# EasyEDA schematic 平衡车3.0.json

## Sheets
1 Sheet_1: TITLE: 平衡车; REV: 1.0; Date: 2022-01-08; Sheet: 1/4; Drawn By: Uchiha-Leslie; Company: 南京师范大学
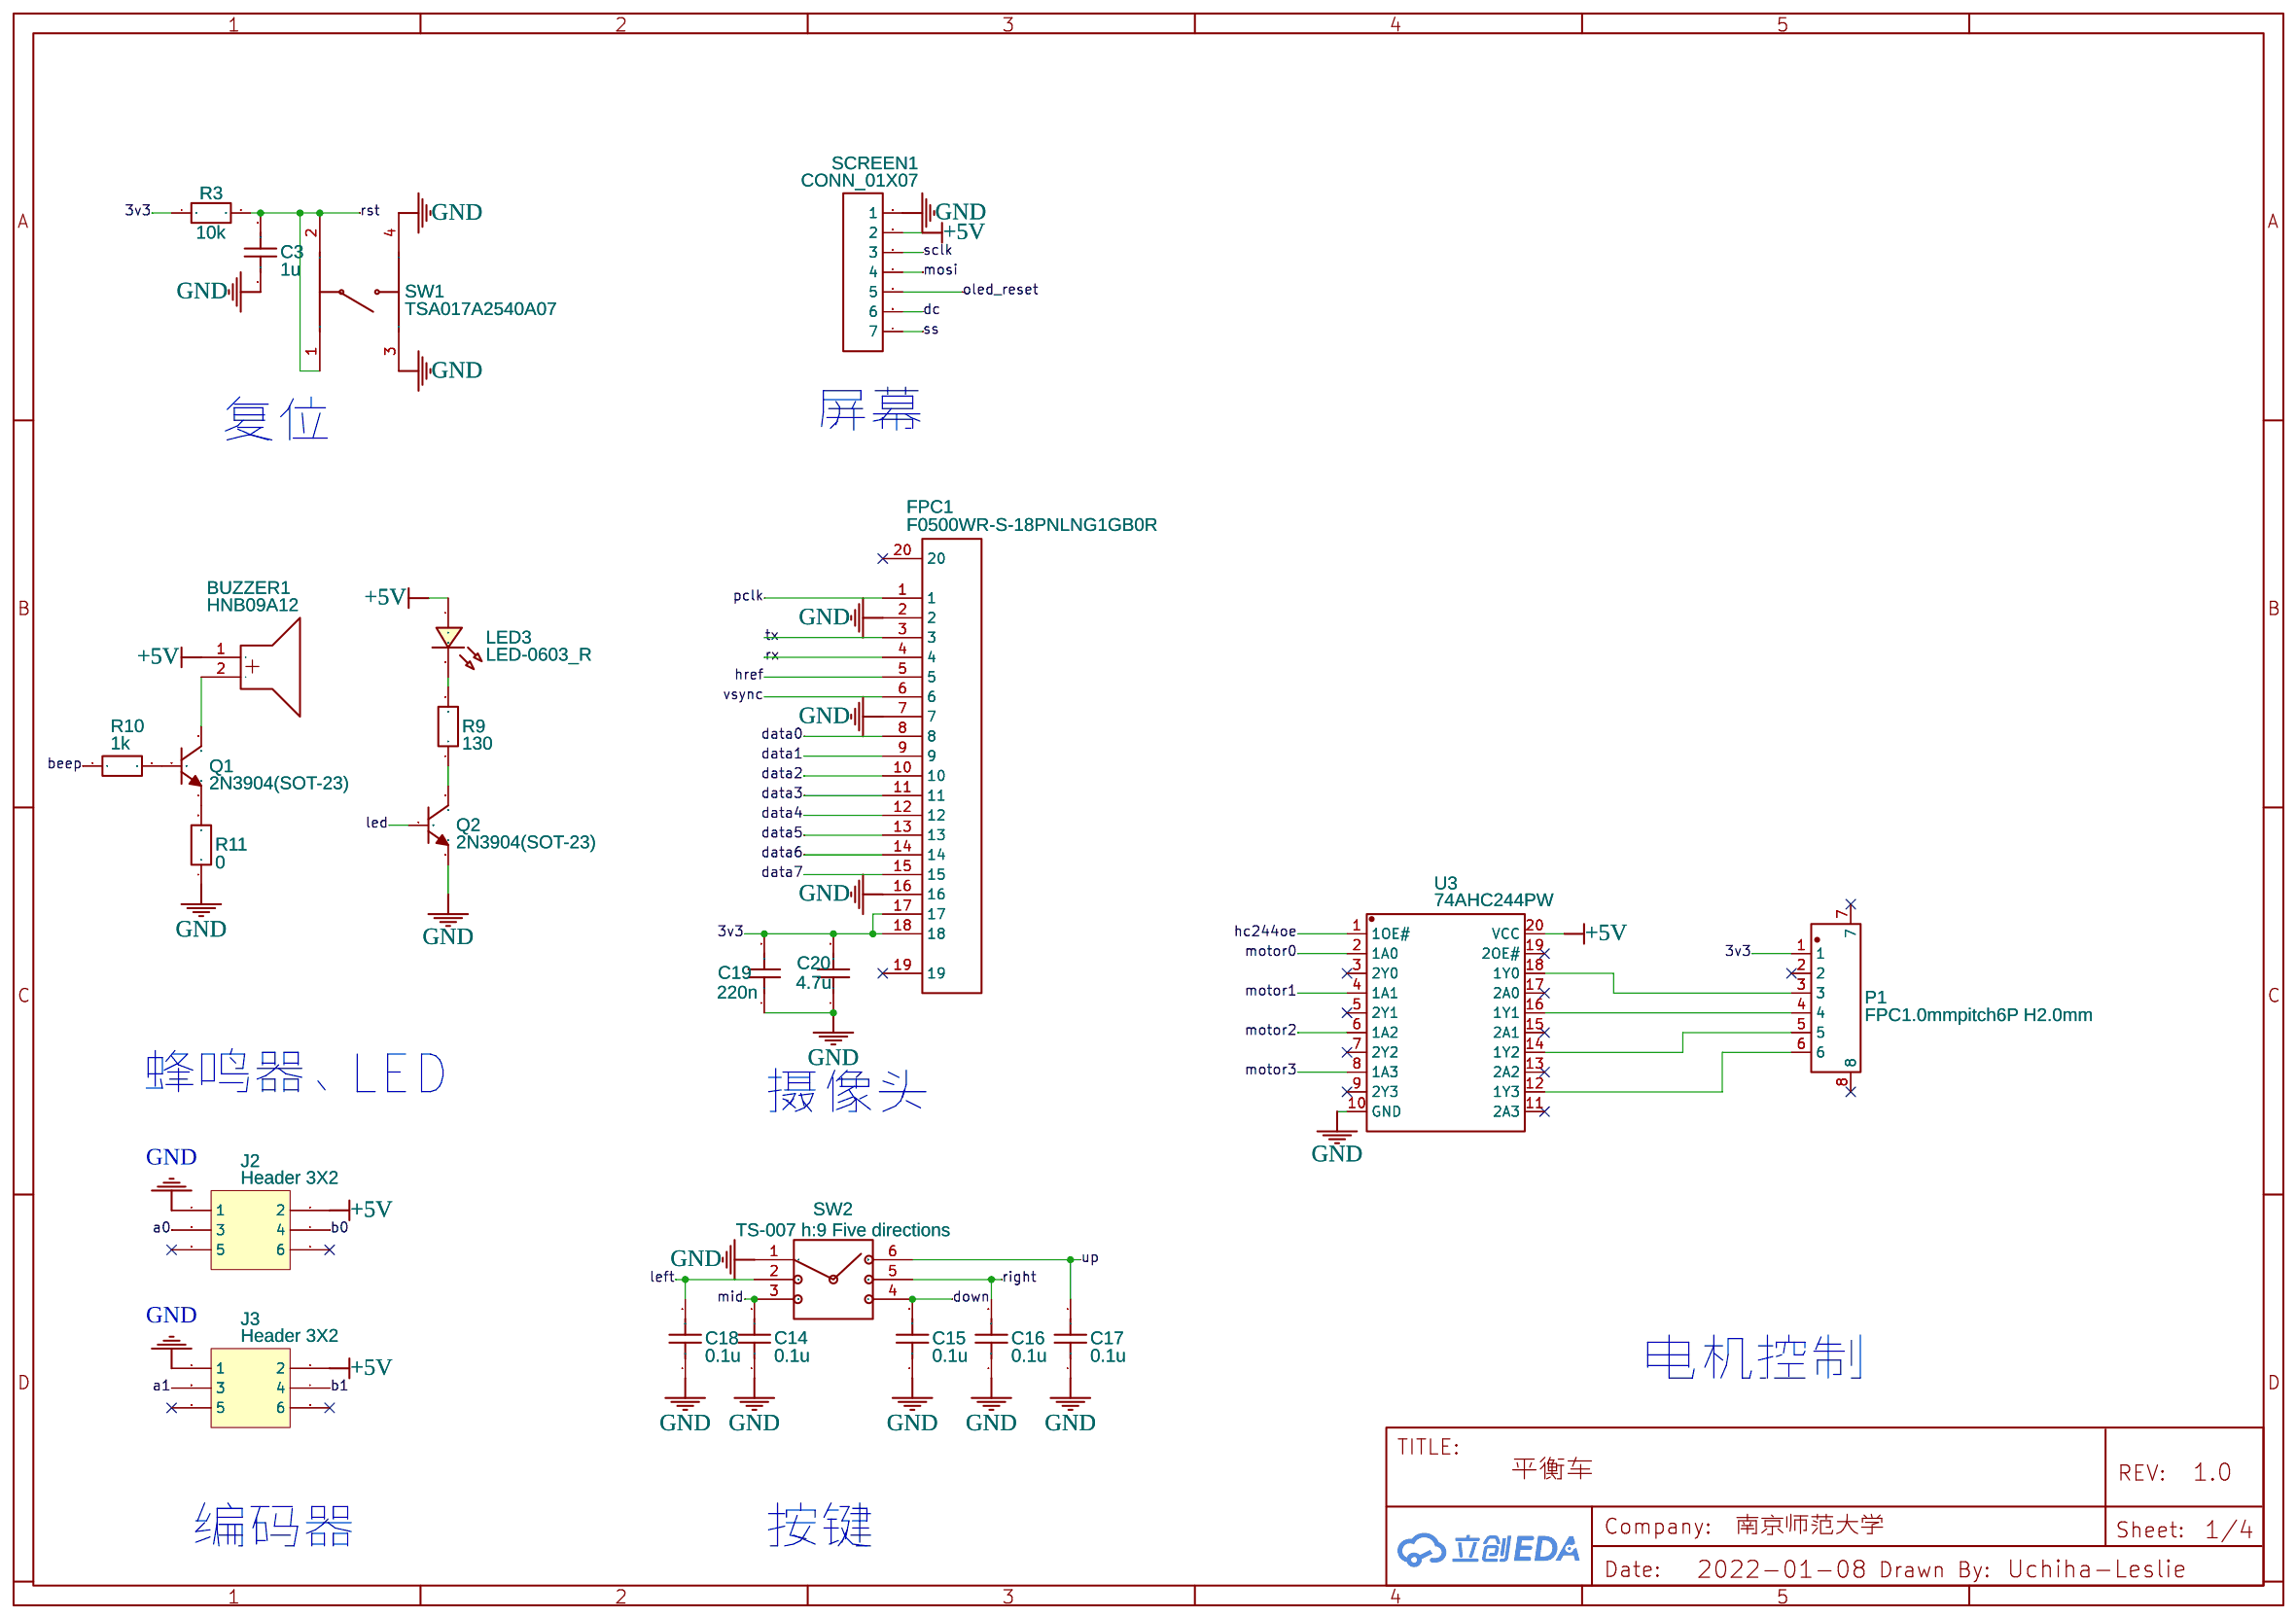
[diagram p0: Sheet_1]
2 电源: TITLE: 电源; Date: 2022-01-09; Sheet: 2/4
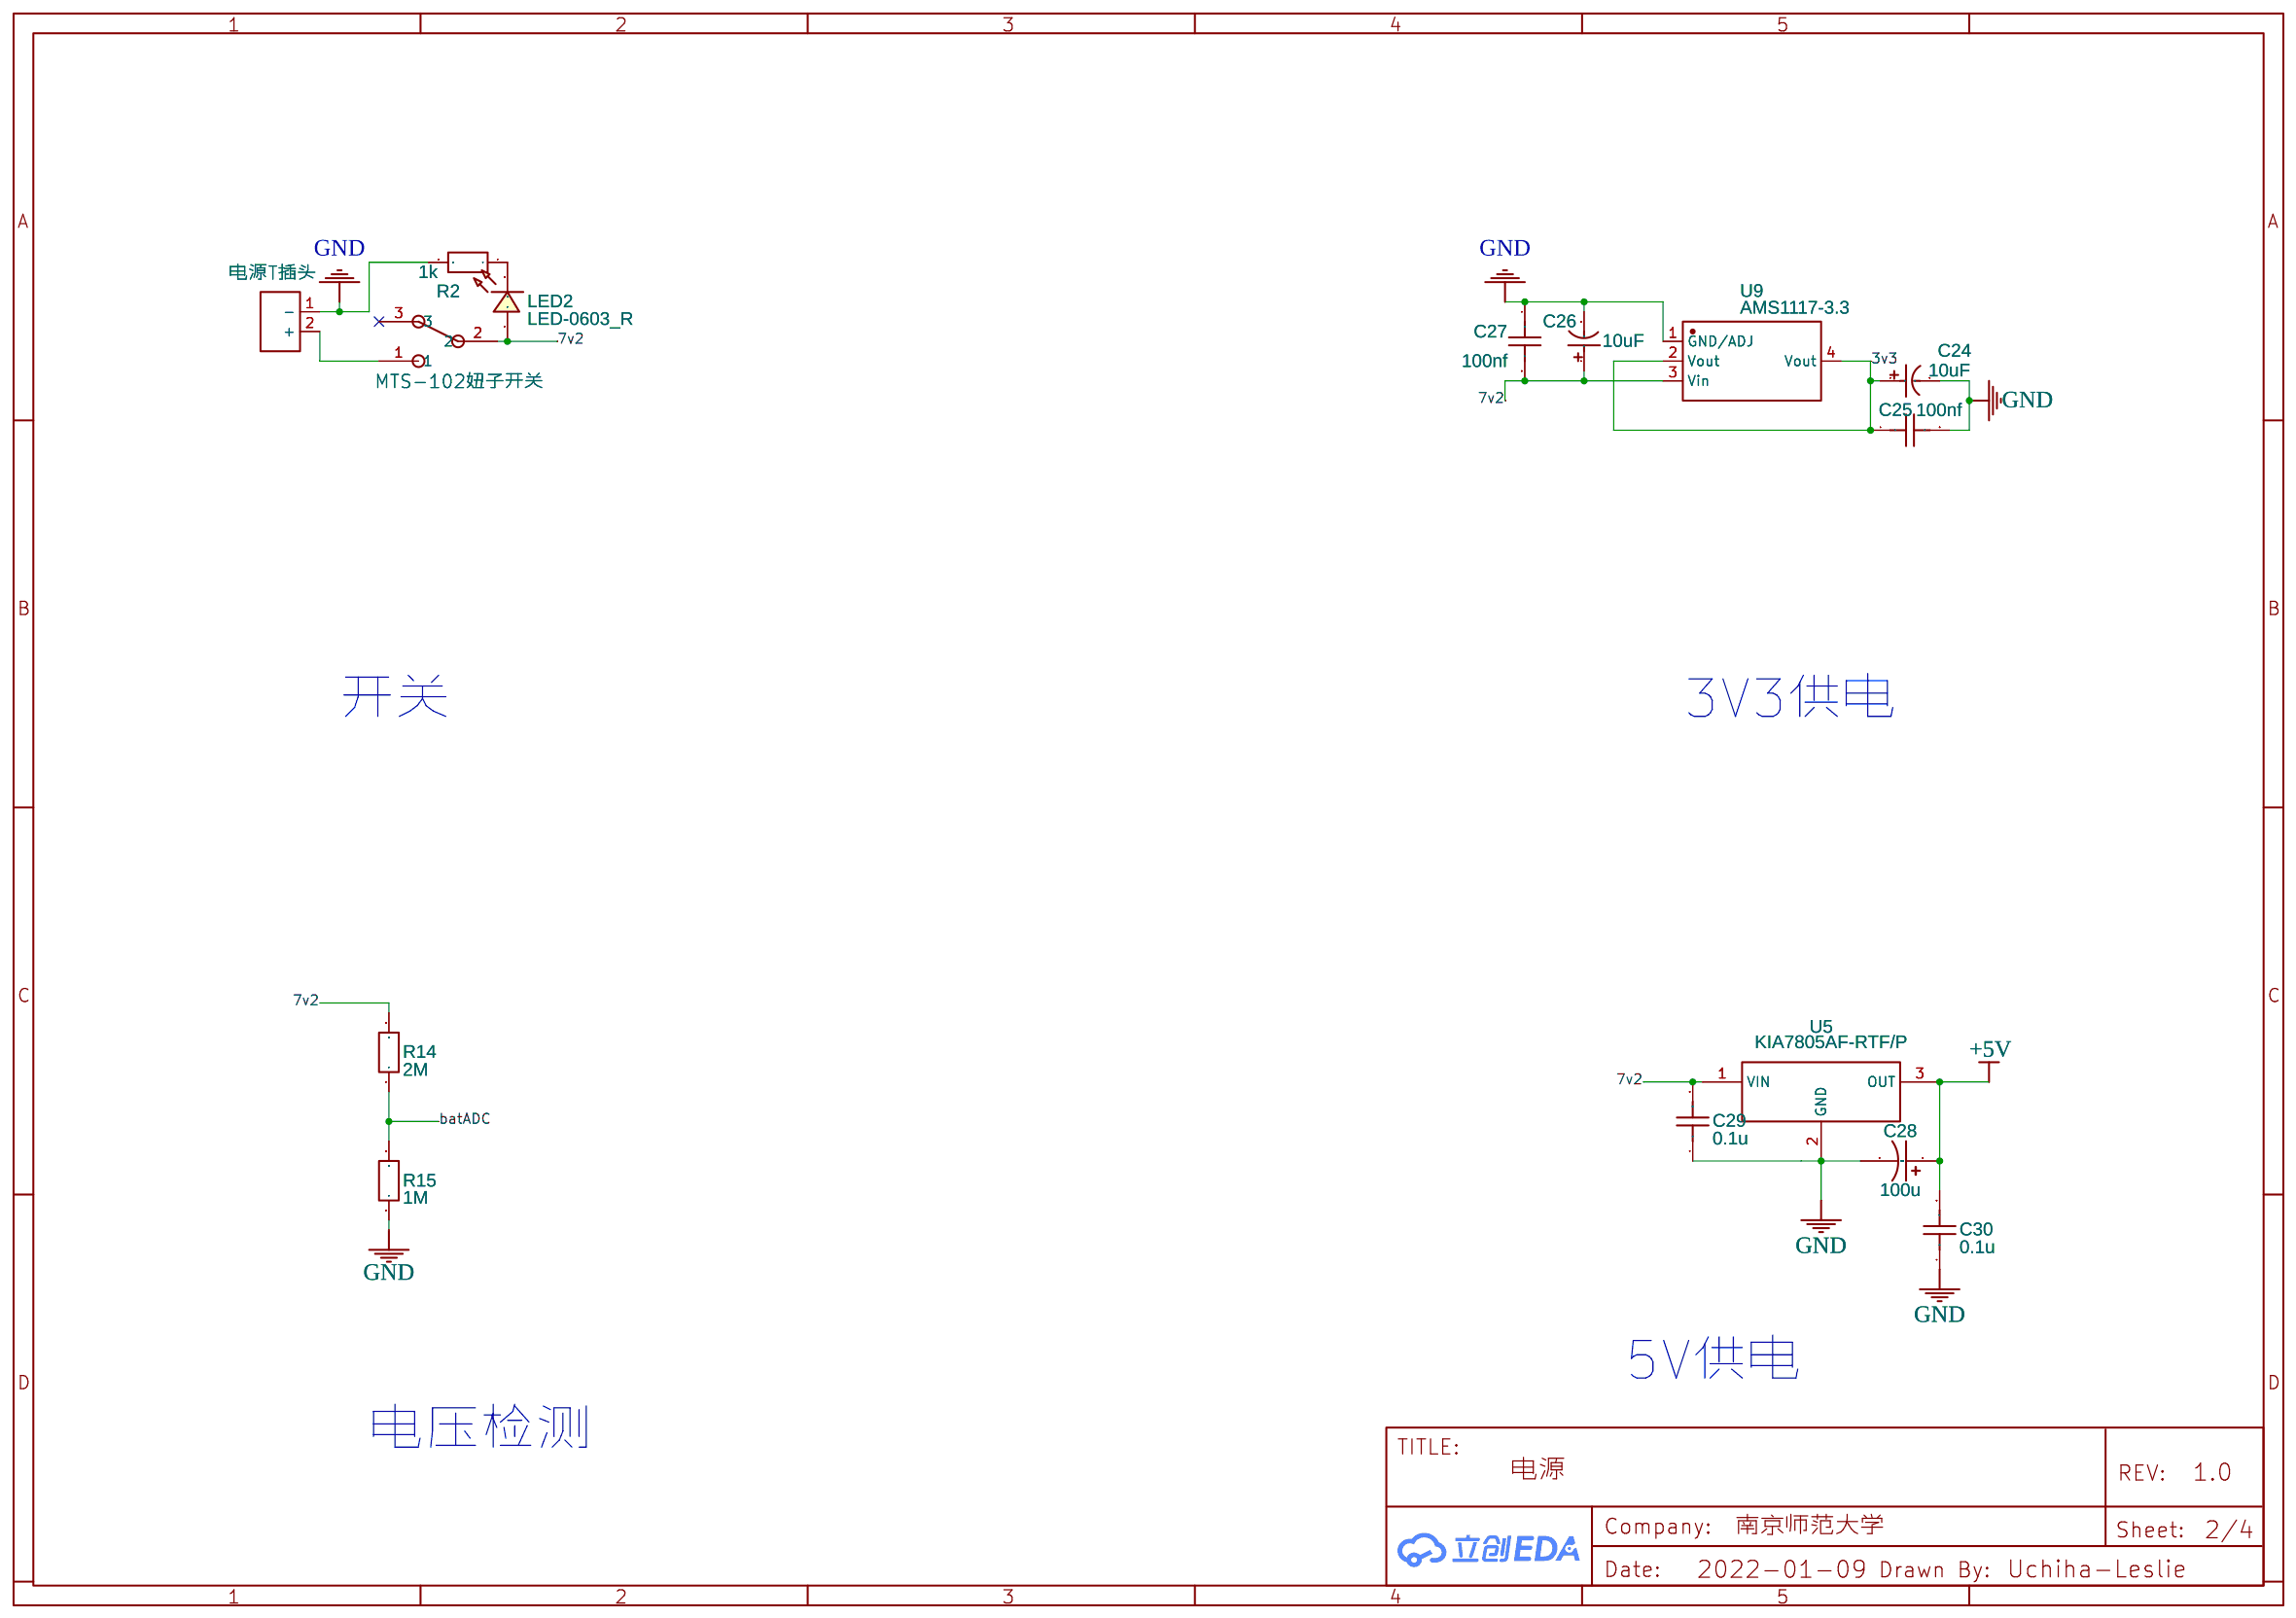
[diagram p1: 电源]
3 MPU/蓝牙: TITLE: MPU6050; Date: 2022-01-09; Sheet: 3/4
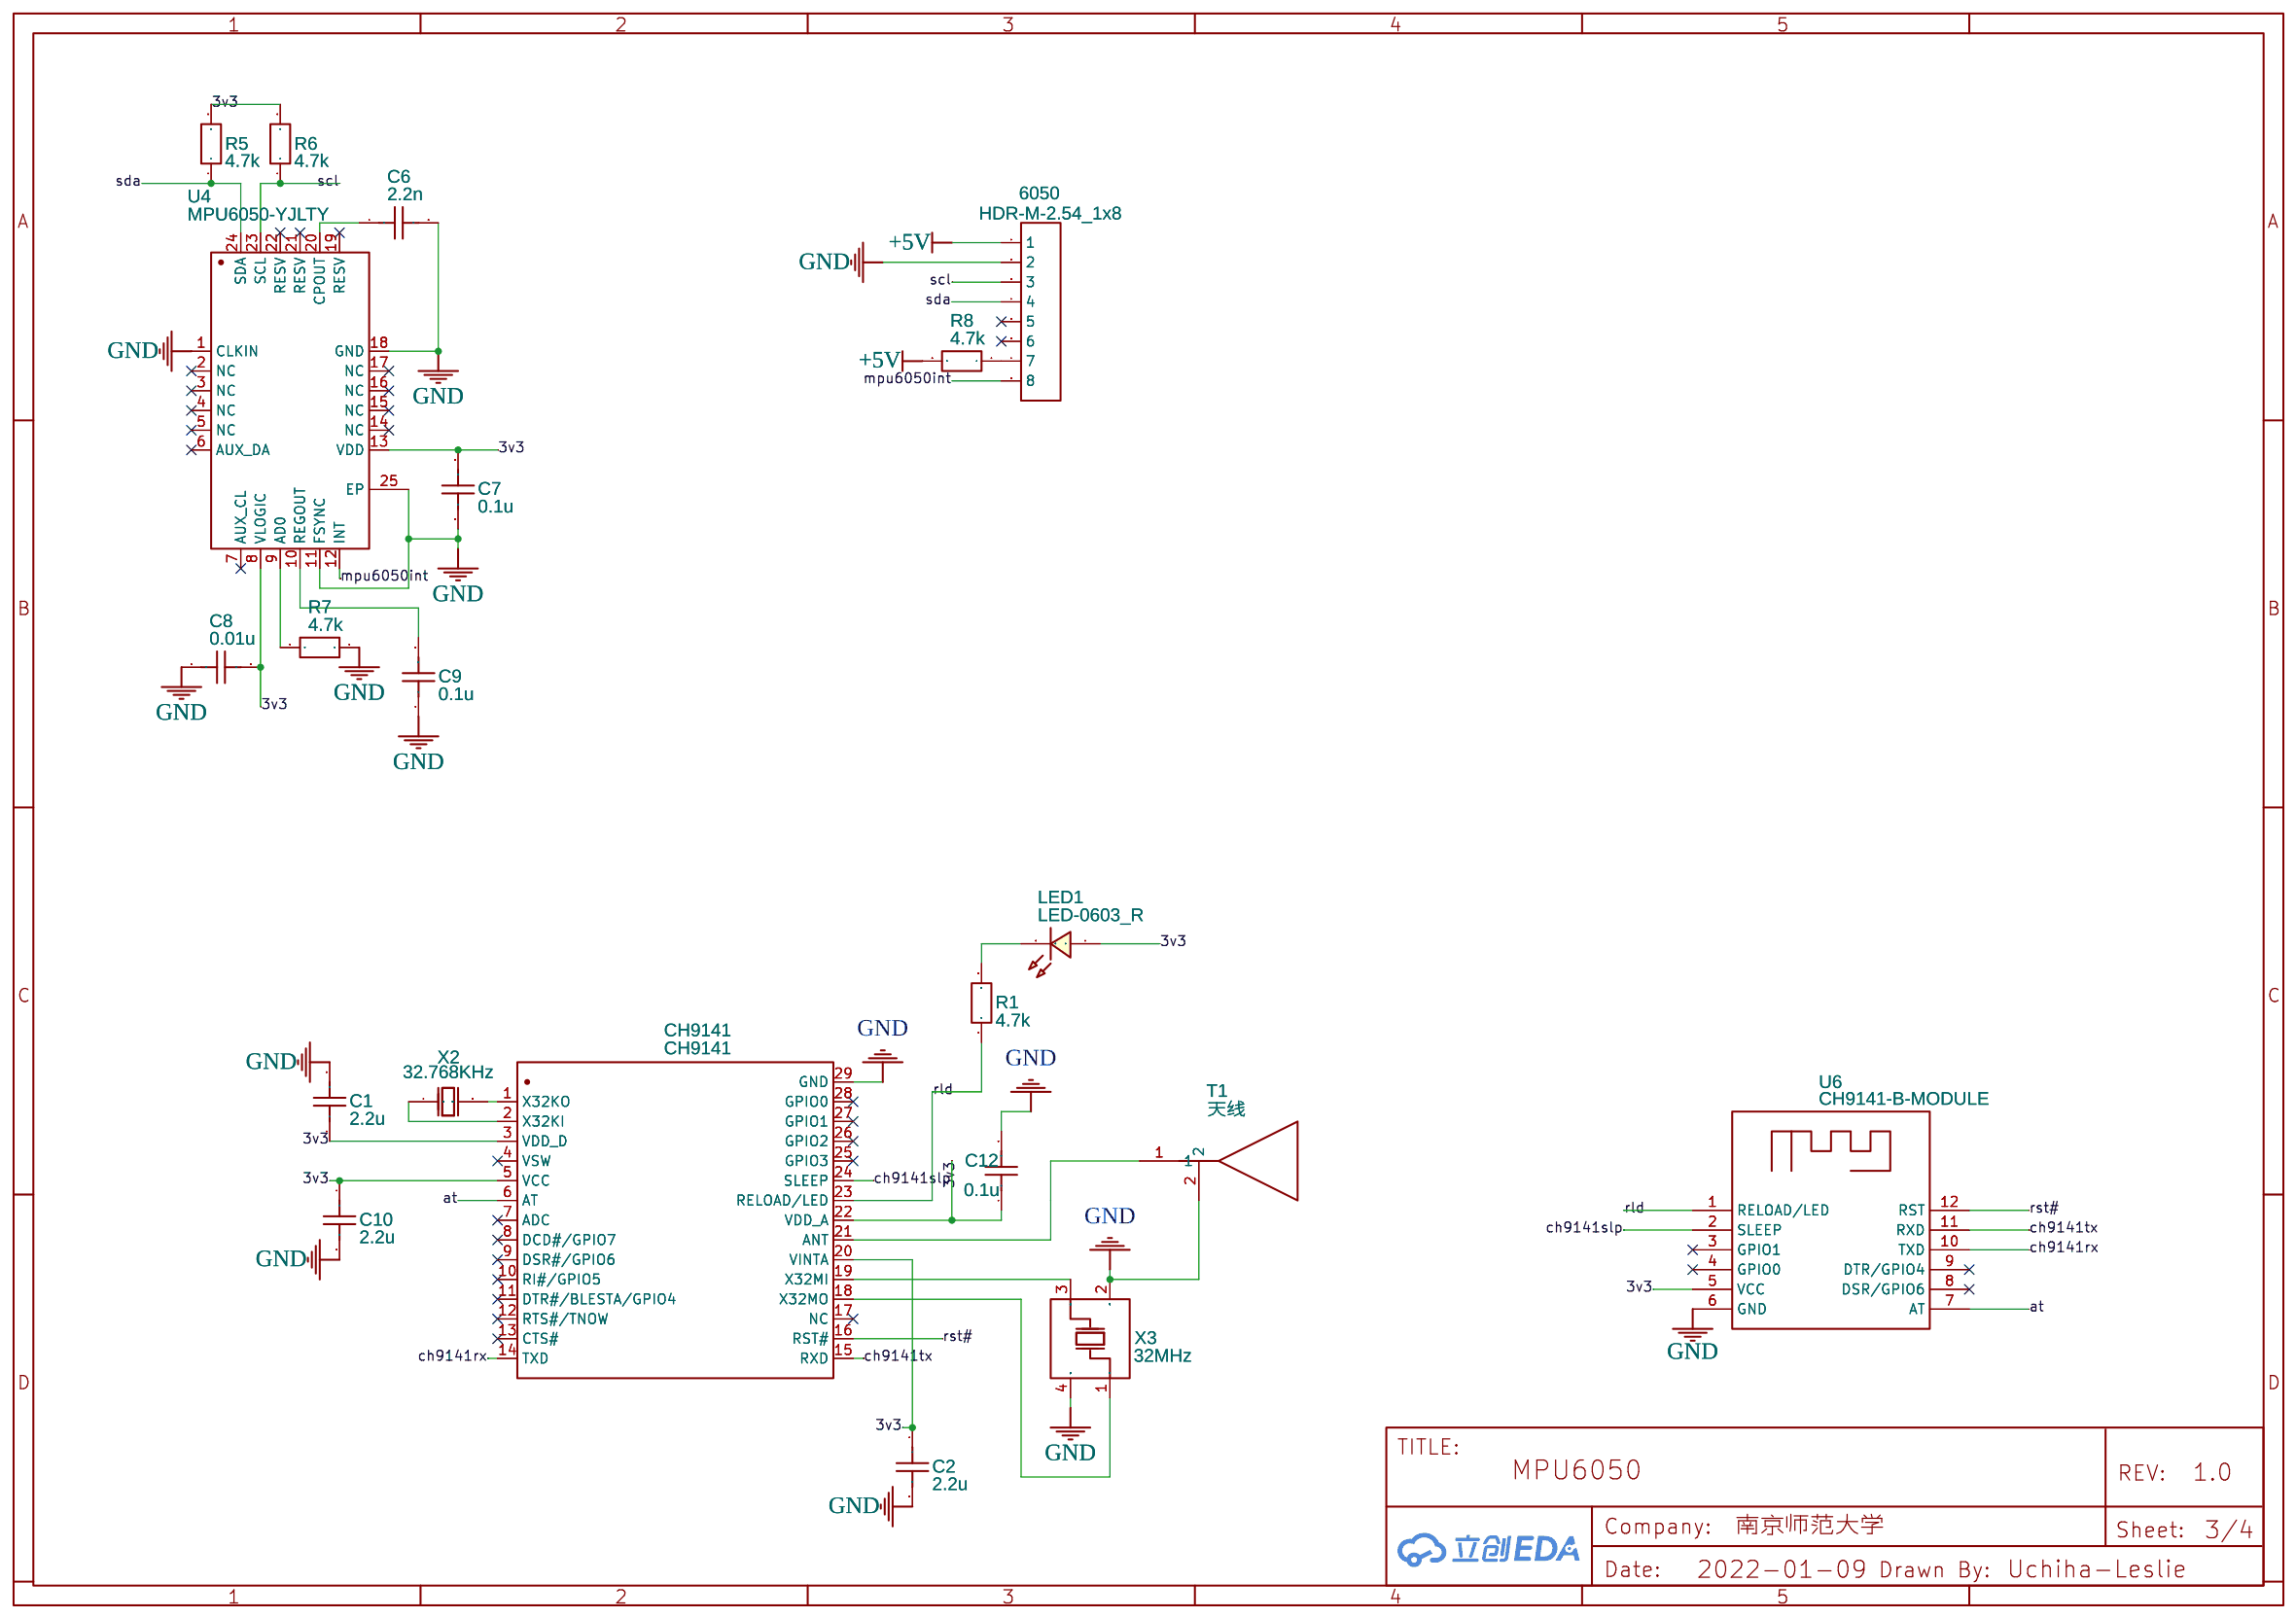
[diagram p2: MPU/蓝牙]
4 MCU: TITLE: Sheet_2; Date: 2022-02-26; Sheet: 4/4; Company: Your Company
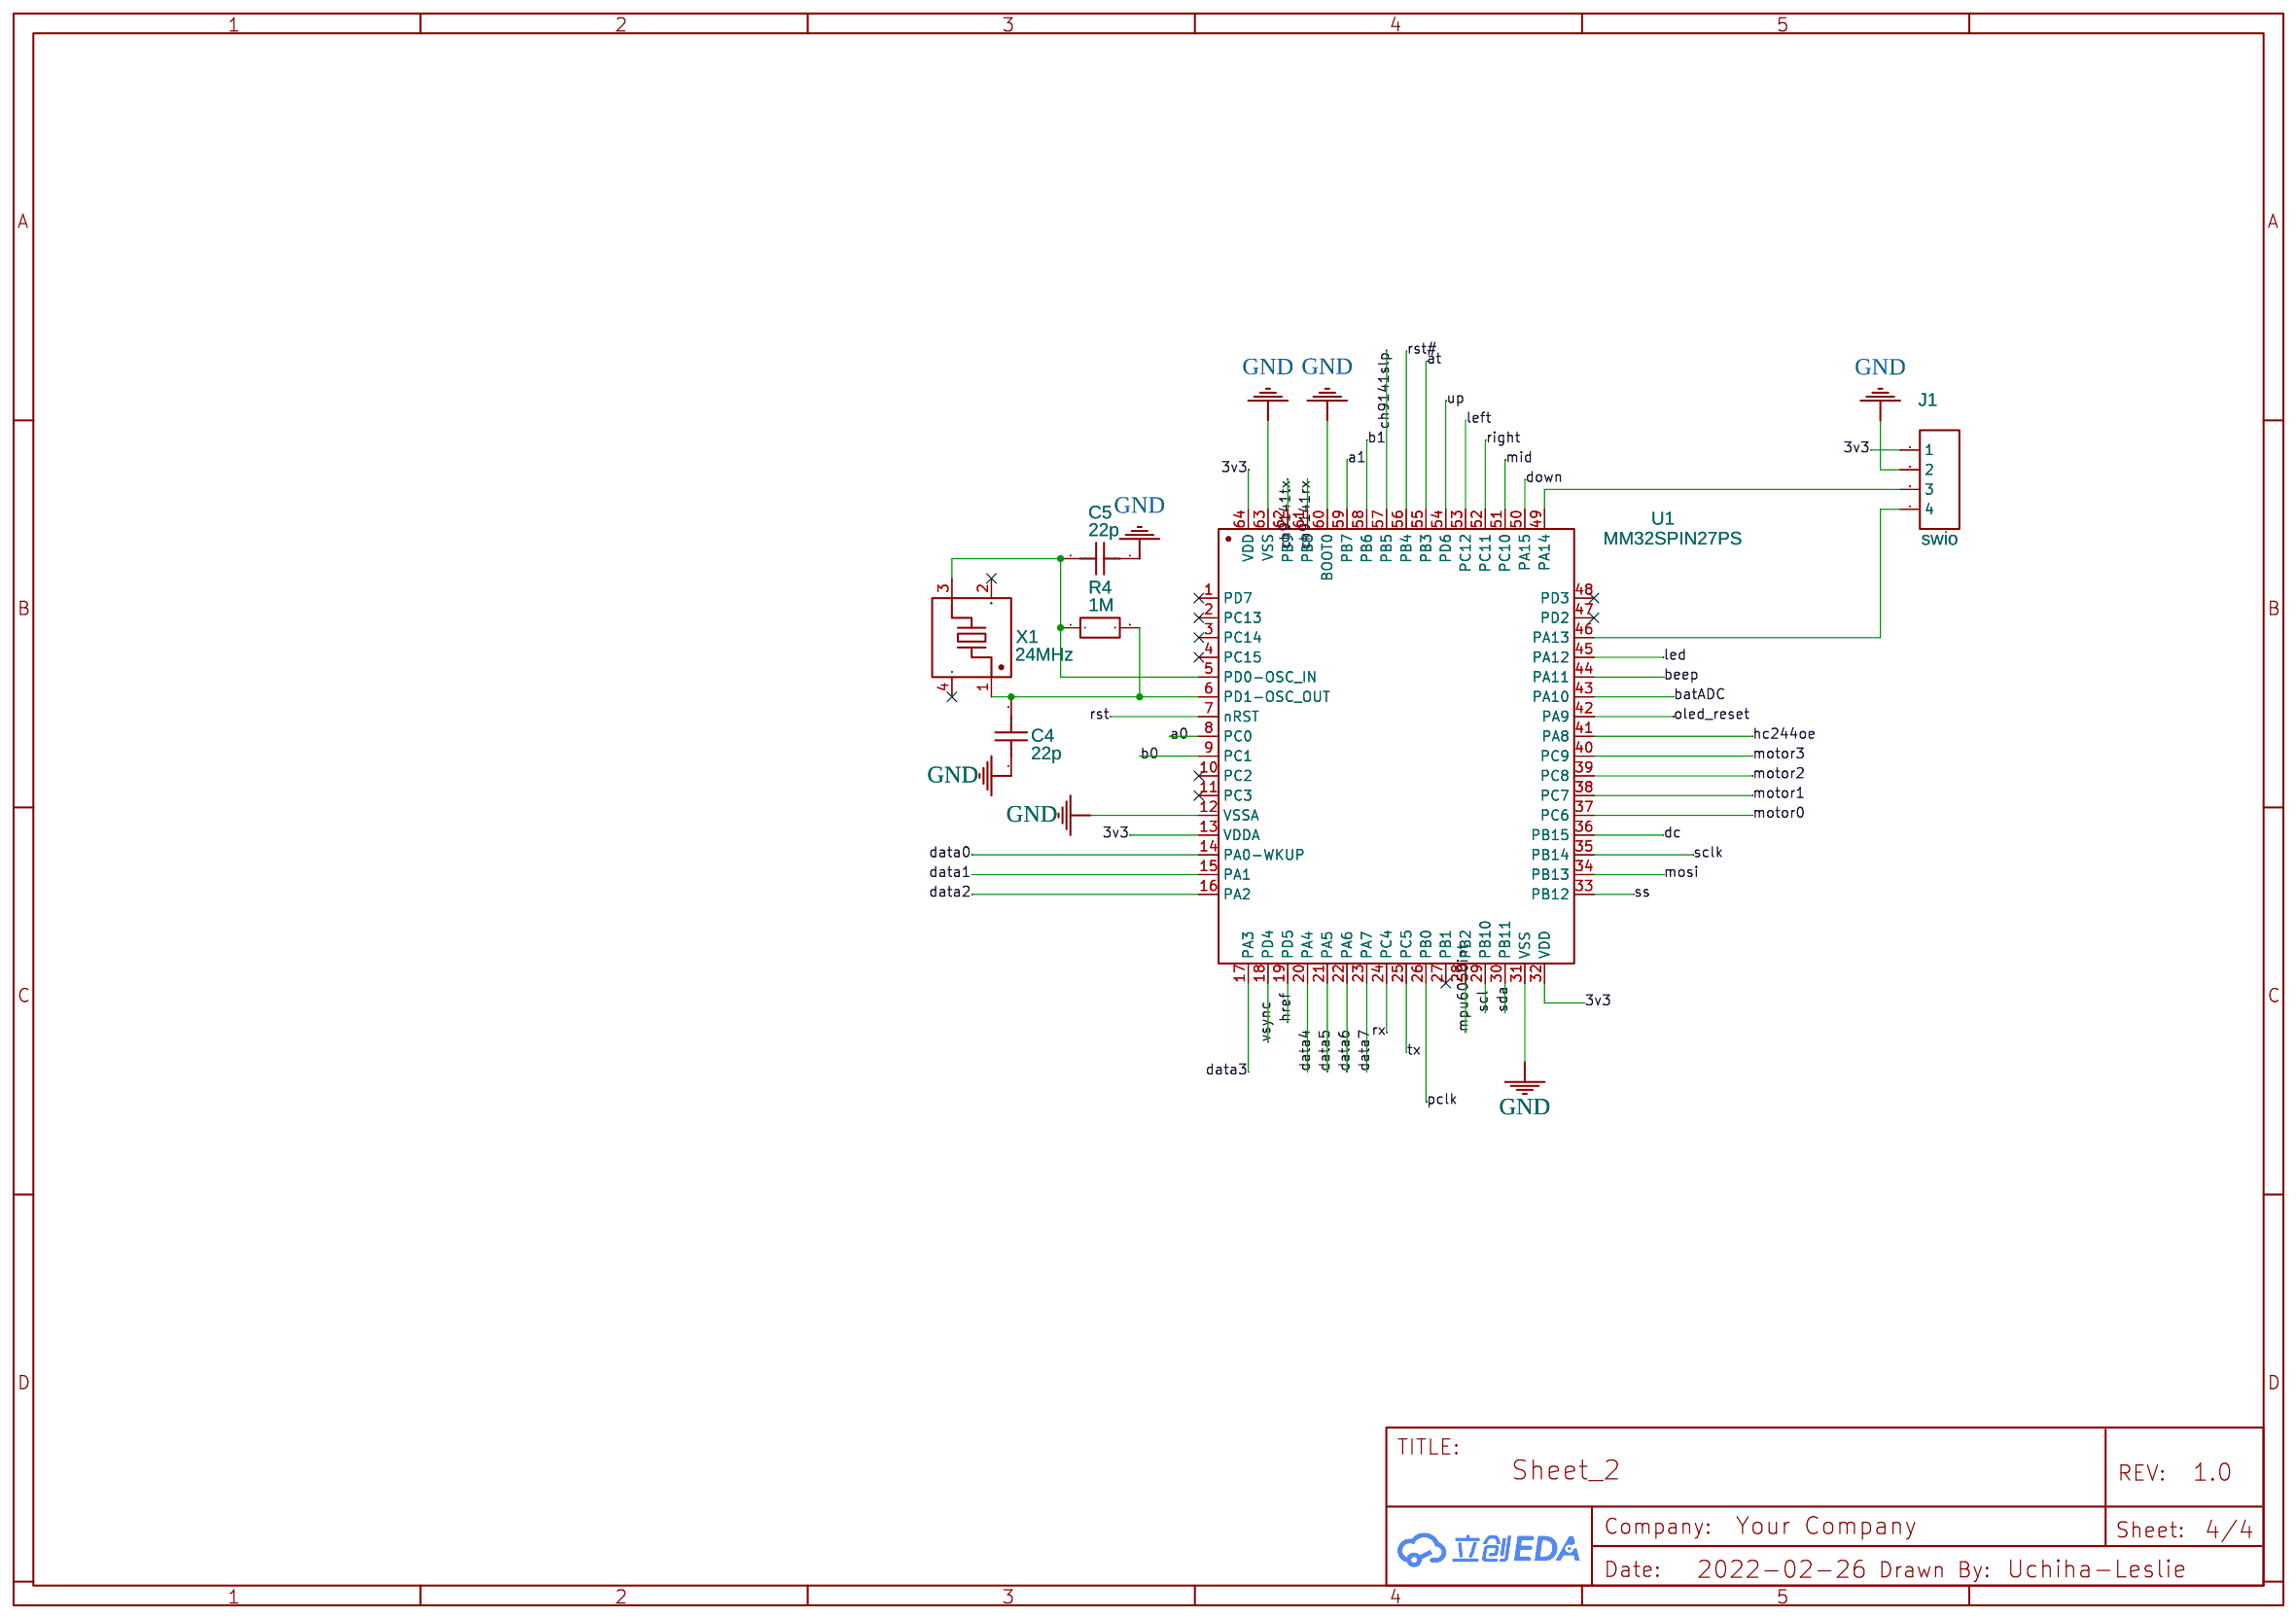
[diagram p3: MCU]

## Parts
sheet MCU
C4  22p  [C0603]
C5  22p  [C0603]
J1  swio  [HDR-M-2.54_1X4]
R4  1M  [R0603]
U1  MM32SPIN27PS  [LQFP-64_L10.0-W10.0-P0.50-LS12.0-BL]
X1  24MHz  [CRYSTAL-SMD_4P-L2.0-W1.6-BL-2]
sheet MPU/蓝牙
6050  HDR-M-2.54_1x8  [HDR-M-2.54_1X8]
C1  2.2u  [C0603]
C2  2.2u  [C0603]
C6  2.2n  [C0603]
C7  0.1u  [C0603]
C8  0.01u  [C0603]
C9  0.1u  [C0603]
C10  2.2u  [C0603]
C12  0.1u  [C0603]
CH9141  CH9141  [QFN-28_L4.0-W4.0-P0.40-BL-EP2.7]
LED1  LED-0603_R  [LED0603_RED]
R1  4.7k  [R0603]
R5  4.7k  [R0603]
R6  4.7k  [R0603]
R7  4.7k  [R0603]
R8  4.7k  [R0603]
T1  天线  [天线]
U4  MPU6050-YJLTY  [QFN-24_L4.0-W4.0-P0.50-BL-EP2.7]
U6  CH9141-B-MODULE  [CH9141-B-MODULE PKG]
X2  32.768KHz  [CRYSTAL-SMD_L3.2-W1.5-1]
X3  32MHz  [CRYSTAL-SMD_4P-L3.2-W2.5-BL]
sheet Sheet_1
BUZZER1  HNB09A12  [BUZ-TH_BD14.1-P7.62-D1.0-FD]
C3  1u  [C0603]
C14  0.1u  [C0603]
C15  0.1u  [C0603]
C16  0.1u  [C0603]
C17  0.1u  [C0603]
C18  0.1u  [C0603]
C19  220n  [C0603]
C20  4.7u  [C0603]
FPC1  F0500WR-S-18PNLNG1GB0R  [FPC-SMD_18P-P0.50_F0500WR-S-18PNLNG1GB0R]
J2  Header 3X2  [编码器]
J3  Header 3X2  [编码器]
LED3  LED-0603_R  [LED0603_RED]
P1  FPC1.0mmpitch6P H2.0mm  [FPC-SMD_6P-L11.0-W5.8-P1.00]
Q1  2N3904(SOT-23)  [SOT-23-3_L2.9-W1.3-P1.90-LS2.4-TR]
Q2  2N3904(SOT-23)  [SOT-23-3_L2.9-W1.3-P1.90-LS2.4-TR]
R3  10k  [R0603]
R9  130  [R0603]
R10  1k  [R0603]
R11  0  [R0603]
SCREEN1  CONN_01X07  [HDR-M-2.54_1X7]
SW1  TSA017A2540A07  [SW-SMD_4P-L4.2-W3.4-P2.15-LS5.2]
SW2  TS-007 h:9 Five directions  [KEY-SMD_TS-007]
U3  74AHC244PW  [TSSOP-20_L6.5-W4.4-P0.65-LS6.4-BL]
sheet 电源
C24  10uF  [CAP-TH_BD4.0-P1.50-D0.8-FD]
C25  100nf  [C0603]
C26  10uF  [CAP-TH_BD4.0-P1.50-D0.8-FD]
C27  100nf  [C0603]
C28  100u  [CAP-D8.0×F3.5]
C29  0.1u  [C0603]
C30  0.1u  [C0603]
H1  电源T插头  [电源T插口]
LED2  LED-0603_R  [LED0603_RED]
R2  1k  [R0603]
R14  2M  [R0603]
R15  1M  [R0603]
U2  MTS-102妞子开关  [MTS102]
U5  KIA7805AF-RTF/P  [TO-252-2_L6.6-W6.1-P4.57-LS9.9-BR-CW]
U9  AMS1117-3.3  [SOT-223-3_L6.5-W3.4-P2.30-LS7.0-BR]

## Library data of the parts
C1-C10 C12 C14-C20 C25 C27 C29 C30 = C_0603_US: Contributor: LCEDA_Lib
J1 = HDR-M-2.54_1x4: Supplier Part: C124378; Supplier: LCSC; Contributor: LCEDA_Lib
R1-R11 R14 R15 = R_0603_EU: Contributor: LCEDA_Lib
U1 = MM32SPIN27PS: Supplier: LCSC; Supplier Part: C2908053; Manufacturer: null; Manufacturer Part: mm32spin27ps; JLCPCB Part Class: Extended Part; Contributor: LCSC
X1 = CN4024M00012T8188012: Supplier: LCSC; Supplier Part: C708987; Manufacturer: JWT; Contributor: LCSC; JLCPCB Part Class: Extended Part
6050 = HDR-M-2.54_1x8: Supplier Part: C190820; Supplier: LCSC; Contributor: LCEDA_Lib
CH9141 = CH9141: Supplier: LCSC; Supplier Part: C2693433; Manufacturer: WCH(南京沁恒); JLCPCB Part Class: Extended Part; Contributor: LCSC
LED1-LED3 = LED-0603_R: Manufacturer: EVERLIGHT(台湾亿光); Manufacturer Part: 19-217/R6C-AL1M2VY/3T; Supplier Part: C72044; Supplier: LCSC; Contributor: LCEDA_01
T1 = 天线: Contributor: yzlvwm
U4 = MPU6050-YJLTY: Supplier: LCSC; Supplier Part: C2912107; Manufacturer: null; JLCPCB Part Class: Extended Part; Contributor: LCSC
U6 = CH9141-B-MODULE: Contributor: zjh2287
X2 = ABS07-32.768KHZ-9-T: Supplier: LCSC; Supplier Part: C179635; Manufacturer: Abracon LLC; Contributor: LCSC; JLCPCB Part Class: Extended Part
X3 = M32000TC142: Supplier: LCSC; Supplier Part: C280076; Manufacturer: ZheJiang East Crystal Elec; Contributor: LCSC; JLCPCB Part Class: Extended Part
BUZZER1 = HNB09A12: Supplier: LCSC; Supplier Part: C122600; Manufacturer: Jiangsu Huaneng Elec; Contributor: LCSC; JLCPCB Part Class: Extended Part
FPC1 = F0500WR-S-18PNLNG1GB0R: Supplier: LCSC; Supplier Part: C247896; Manufacturer: Joint Tech Elec; Contributor: LCSC; JLCPCB Part Class: Extended Part
J2 J3 = Header 3X2: LatestRevisionDate: 17-Jul-2002; LatestRevisionNote: Re-released for DXP Platform.; Publisher: Altium Limited; Contributor: jhn11996
P1 = FPC1.0mmpitch6P H2.0mm: Supplier: LCSC; Manufacturer: BOOMELE; Manufacturer Part: FPC1.0mmpitch6P H2.0mm翻盖式下接式; Supplier Part: C29804; JLCPCB Part Class: Extended Part
Q1 Q2 = 2N3904(SOT-23): Supplier: LCSC; Manufacturer: KEC; Manufacturer Part: 2n3904S-RTK/PS; Supplier Part: C18536; Paste Type: SOT-23; Contributor: LCEDA_Lib
SCREEN1 = CONN_01X07: Contributor: KiCAD
SW1 = TSA017A2540A07: Supplier: LCSC; Supplier Part: C2888434; Manufacturer: BZCN(博众电气); Contributor: LCSC
SW2 = TS-007 h:9 Five directions: Supplier Part: C3679; Supplier: LCSC; Manufacturer: ReliaPro
U3 = 74AHC244PW: Supplier: LCSC; Manufacturer: PHILIPS; Supplier Part: C5515; JLCPCB Part Class: Extended Part
C24 C26 = 10uF 16V 3*5: Supplier: LCSC; Manufacturer: ValuePro; Supplier Part: C43798; JLCPCB Part Class: Extended Part
C28 = CE_TH_D8.0×F3.5_US: Contributor: LCEDA_Lib
H1 = 电源T插头: Manufacturer: TE Connectivity; Manufacturer Part: 3-644456-2; Supplier Part: C90288; Contributor: JiaMinghui
U2 = MTS-102妞子开关: Contributor: IoT-J
U5 = KIA7805AF-RTF/P: Supplier: LCSC; Manufacturer: KEC; Supplier Part: C69755; JLCPCB Part Class: Extended Part
U9 = AMS1117-3.3: sourceId: dwIGgezVh; Supplier: LCSC; Manufacturer: AMS; Supplier Part: C6186; JLCPCB Part Class: Basic Part

## Nets
3v3: C1.1 C2.1 C7.2 C8.2 C10.1 C12.1 C19.2 C20.2 C24.1 C25.1 CH9141.3(VDD_D) CH9141.5(VCC) CH9141.20(VINTA) CH9141.22(VDD_A) FPC1.17 FPC1.18 J1.1 LED1.1 P1.1 R3.1 R5.2 R6.2 U1.13(VDDA) U1.32(VDD) U1.64(VDD) U4.8(VLOGIC) U4.13(VDD) U6.5(VCC) U9.2(Vout) U9.4(Vout)
7v2: C26.1 C27.2 C29.2 LED2.1 R14.2 U2.2 U5.1(VIN) U9.3(Vin)
+5V: 6050.1 BUZZER1.1(+) C28.1 C30.2 J2.2 J3.2 LED3.1 R8.2 SCREEN1.2 U3.20(VCC) U5.3(OUT)
GND: 6050.2 C1.2 C2.2 C3.1 C4.1 C5.1 C6.2 C7.1 C8.1 C9.1 C10.2 C12.2 C14.1 C15.1 C16.1 C17.1 C18.1 C19.1 C20.1 C24.2 C25.2 C26.2 C27.1 C28.2 C29.1 C30.1 CH9141.29(GND) FPC1.2 FPC1.7 FPC1.16 H1.1(-) J1.2 J2.1 J3.1 Q2.1(E) R2.2 R7.1 R11.1 R15.1 SCREEN1.1 SW1.3 SW1.4 SW2.1 T1.2 U1.12(VSSA) U1.31(VSS) U1.60(BOOT0) U1.63(VSS) U3.10(GND) U4.1(CLKIN) U4.11(FSYNC) U4.18(GND) U4.25(EP) U5.2(GND) U6.6(GND) U9.1(GND/ADJ) X3.2(GND) X3.4(GND)
a0: J2.3 U1.8(PC0)
a1: J3.3 U1.59(PB7)
at: CH9141.6(AT) U1.55(PB3) U6.7(AT)
b0: J2.4 U1.9(PC1)
b1: J3.4 U1.58(PB6)
batADC: R14.1 R15.2 U1.43(PA10)
beep: R10.1 U1.44(PA11)
ch9141rx: CH9141.14(TXD) U1.61(PB8) U6.10(TXD)
ch9141slp: CH9141.24(SLEEP) U1.57(PB5) U6.2(SLEEP)
ch9141tx: CH9141.15(RXD) U1.62(PB9) U6.11(RXD)
data0: FPC1.8 U1.14(PA0-WKUP)
data1: FPC1.9 U1.15(PA1)
data2: FPC1.10 U1.16(PA2)
data3: FPC1.11 U1.17(PA3)
data4: FPC1.12 U1.20(PA4)
data5: FPC1.13 U1.21(PA5)
data6: FPC1.14 U1.22(PA6)
data7: FPC1.15 U1.23(PA7)
dc: SCREEN1.6 U1.36(PB15)
down: C15.2 SW2.4 U1.50(PA15)
hc244oe: U1.41(PA8) U3.1(1OE#)
href: FPC1.5 U1.19(PD5)
led: Q2.2(B) U1.45(PA12)
left: C18.2 SW2.2 U1.53(PC12)
mid: C14.2 SW2.3 U1.51(PC10)
mosi: SCREEN1.4 U1.34(PB13)
motor0: U1.37(PC6) U3.2(1A0)
motor1: U1.38(PC7) U3.4(1A1)
motor2: U1.39(PC8) U3.6(1A2)
motor3: U1.40(PC9) U3.8(1A3)
mpu6050int: 6050.8 U1.28(PB2) U4.12(INT)
oled_reset: SCREEN1.5 U1.42(PA9)
pclk: FPC1.1 U1.26(PB0)
right: C16.2 SW2.5 U1.52(PC11)
rld: CH9141.23(RELOAD/LED) R1.1 U6.1(RELOAD/LED)
rst: C3.2 R3.2 SW1.1 SW1.2 U1.7(nRST)
rst#: CH9141.16(RST#) U1.56(PB4) U6.12(RST)
rx: FPC1.4 U1.24(PC4)
scl: 6050.3 R6.1 U1.29(PB10) U4.23(SCL)
sclk: SCREEN1.3 U1.35(PB14)
sda: 6050.4 R5.1 U1.30(PB11) U4.24(SDA)
ss: SCREEN1.7 U1.33(PB12)
tx: FPC1.3 U1.25(PC5)
up: C17.2 SW2.6 U1.54(PD6)
vsync: FPC1.6 U1.18(PD4)
Net-(6050-7): 6050.7 R8.1
Net-(BUZZER1-2): BUZZER1.2(-) Q1.3(C)
Net-(C4-2): C4.2 R4.2 U1.6(PD1-OSC_OUT) X1.1
Net-(C5-2): C5.2 R4.1 U1.5(PD0-OSC_IN) X1.3
Net-(C6-1): C6.1 U4.20(CPOUT)
Net-(C9-2): C9.2 U4.10(REGOUT)
Net-(CH9141-1): CH9141.1(X32KO) X2.2(OSC2)
Net-(CH9141-2): CH9141.2(X32KI) X2.1(OSC1)
Net-(CH9141-18): CH9141.18(X32MO) X3.1(OSC1)
Net-(CH9141-19): CH9141.19(X32MI) X3.3(OSC2)
Net-(CH9141-21): CH9141.21(ANT) T1.1
Net-(H1-2): H1.2(+) U2.1
Net-(J1-3): J1.3 U1.49(PA14)
Net-(J1-4): J1.4 U1.46(PA13)
Net-(LED1-2): LED1.2 R1.2
Net-(LED2-2): LED2.2 R2.1
Net-(LED3-2): LED3.2 R9.2
Net-(P1-3): P1.3 U3.18(1Y0)
Net-(P1-4): P1.4 U3.16(1Y1)
Net-(P1-5): P1.5 U3.14(1Y2)
Net-(P1-6): P1.6 U3.12(1Y3)
Net-(Q1-1): Q1.1(E) R11.2
Net-(Q1-2): Q1.2(B) R10.2
Net-(Q2-3): Q2.3(C) R9.1
Net-(R7-2): R7.2 U4.9(AD0)

Not connected (* = marked no-connect by the designer): 6050 5* 6*; CH9141 4(VSW)* 7(ADC)* 8(DCD#/GPIO7)* 9(DSR#/GPIO6)* 10(RI#/GPIO5)* 11(DTR#/BLESTA/GPIO4)* 12(RTS#/TNOW)* 13(CTS#)* 17(NC)* 25(GPIO3)* 26(GPIO2)* 27(GPIO1)* 28(GPIO0)*; FPC1 19* 20*; J2 5* 6*; J3 5* 6*; P1 2* 7* 8*; U1 1(PD7)* 2(PC13)* 3(PC14)* 4(PC15)* 10(PC2)* 11(PC3)* 27(PB1)* 47(PD2)* 48(PD3)*; U2 3*; U3 3(2Y0)* 5(2Y1)* 7(2Y2)* 9(2Y3)* 11(2A3)* 13(2A2)* 15(2A1)* 17(2A0)* 19(2OE#)*; U4 2(NC)* 3(NC)* 4(NC)* 5(NC)* 6(AUX_DA)* 7(AUX_CL)* 14(NC)* 15(NC)* 16(NC)* 17(NC)* 19(RESV)* 21(RESV)* 22(RESV)*; U6 3(GPIO1)* 4(GPIO0)* 8(DSR/GPIO6)* 9(DTR/GPIO4)*; X1 2(GND)* 4(GND)*

## Notes on the sheets
sheet 1
- 屏幕
- 复位
- 蜂鸣器、LED
- 摄像头
- 电机控制
- 编码器
- 按键
sheet 2
- 开关
- 3V3供电
- 5V供电
- 电压检测
